# EAGLE design maze001 (EAGLE 5.04)
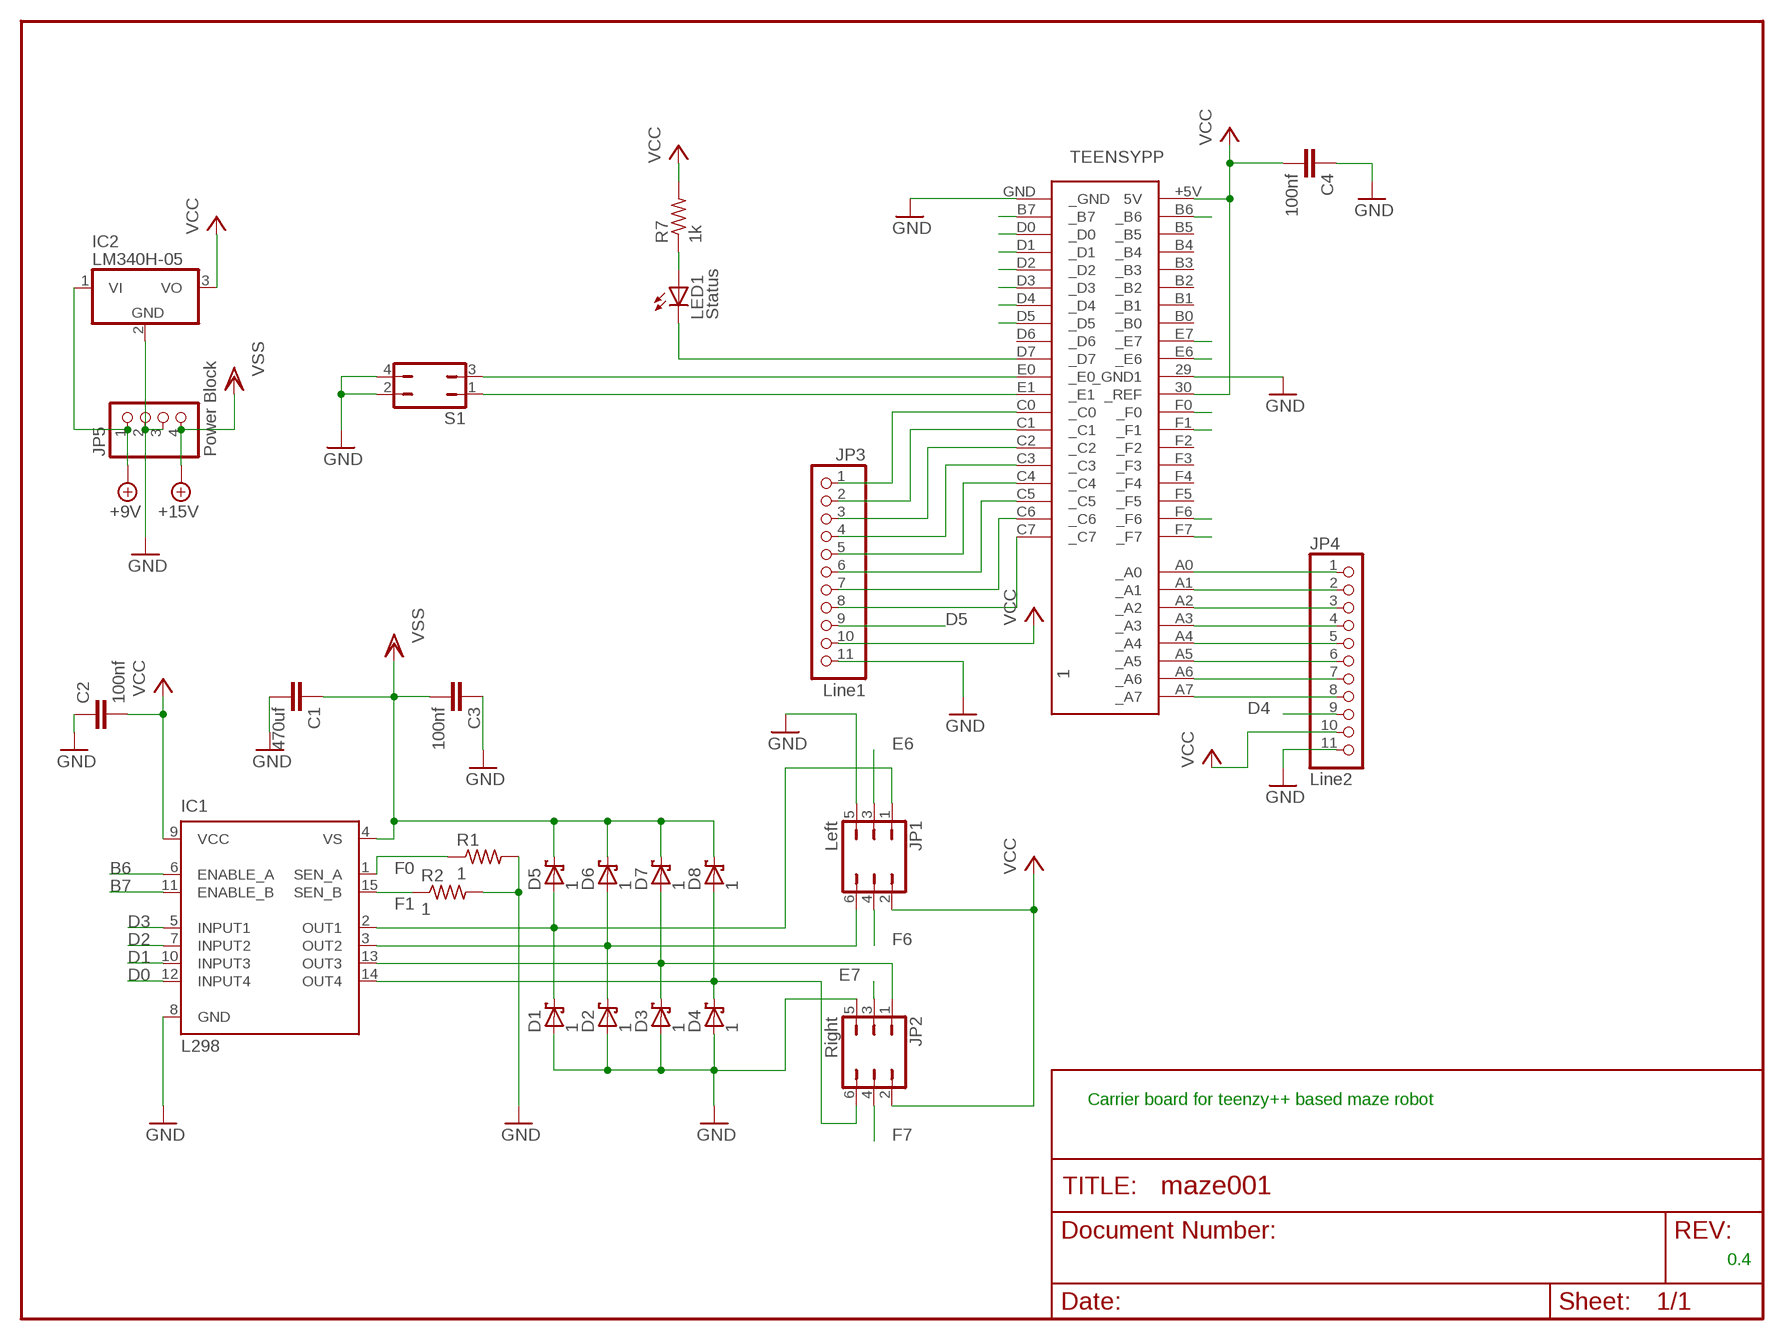
[diagram p0: schematic, sheet 1]

## Parts
C1  470uf  C2,5-3  [C2.5-3]
C2  100nf  C2,5-3  [C2.5-3]
C3  100nf  C2,5-3  [C2.5-3]
C4  100nf  C2,5-3  [C2.5-3]
D1  1  SCHOTTKY-DIODETO92H  [TO92H]
D2  1  SCHOTTKY-DIODETO92H  [TO92H]
D3  1  SCHOTTKY-DIODETO92H  [TO92H]
D4  1  SCHOTTKY-DIODETO92H  [TO92H]
D5  1  SCHOTTKY-DIODETO92H  [TO92H]
D6  1  SCHOTTKY-DIODETO92H  [TO92H]
D7  1  SCHOTTKY-DIODETO92H  [TO92H]
D8  1  SCHOTTKY-DIODETO92H  [TO92H]
IC1  L298  [MULTIWATT-15]
IC2  LM340H-05  [TO220H]
JP1  Left  JP3Q  [JP3Q]
JP2  Right  JP3Q  [JP3Q]
JP3  Line1  PINHD-1X11  [1X11]
JP4  Line2  PINHD-1X11  [1X11]
JP5  Power Block  PINHD-1X4  [1X04]
LED1  Status  LEDLD260  [LD260]
R1  1  R-US_0204/7  [0204/7]
R2  1  R-US_0204/7  [0204/7]
R7  1k  R-US_0204/7  [0204/7]
S1  JP2Q  [JP2Q]
TEENSYPP  1  TEENSYPP  [TEENSYPP]

## Nets
+9V: IC2.1(VI) JP5.1
B6: IC1.6(ENABLE_A) TEENSYPP.B6(_B6)
B7: IC1.11(ENABLE_B) TEENSYPP.B7(_B7)
D0: IC1.12(INPUT4) TEENSYPP.D0(_D0)
D1: IC1.10(INPUT3) TEENSYPP.D1(_D1)
D2: IC1.7(INPUT2) TEENSYPP.D2(_D2)
D3: IC1.5(INPUT1) TEENSYPP.D3(_D3)
D4: JP4.9 TEENSYPP.D4(_D4)
D5: JP3.9 TEENSYPP.D5(_D5)
E6: JP1.3 TEENSYPP.E6(_E6)
E7: JP2.3 TEENSYPP.E7(_E7)
F0: IC1.1(SEN_A) R1.1 TEENSYPP.F0(_F0)
F1: IC1.15(SEN_B) R2.1 TEENSYPP.F1(_F1)
F6: JP1.4 TEENSYPP.F6(_F6)
F7: JP2.4 TEENSYPP.F7(_F7)
GND: C1.2 C2.1 C3.1 C4.1 D1.1(A) D2.1(A) D3.1(A) D4.1(A) IC1.8(GND) IC2.2(GND) JP1.5 JP2.5 JP3.11 JP4.11 JP5.2 JP5.3 R1.2 R2.2 S1.2 S1.4 TEENSYPP.29(_GND1) TEENSYPP.GND(_GND)
N$1: LED1.K(C) TEENSYPP.D7(_D7)
N$2: S1.3 TEENSYPP.E0(_E0)
N$3: JP3.8 TEENSYPP.C7(_C7)
N$4: JP3.7 TEENSYPP.C6(_C6)
N$5: JP3.6 TEENSYPP.C5(_C5)
N$6: JP4.7 TEENSYPP.A6(_A6)
N$7: JP4.2 TEENSYPP.A1(_A1)
N$8: D3.2(C) D7.1(A) IC1.13(OUT3) JP2.1
N$9: LED1.A R7.1
N$10: D1.2(C) D5.1(A) IC1.2(OUT1) JP1.1
N$11: D2.2(C) D6.1(A) IC1.3(OUT2) JP1.6
N$12: JP3.2 TEENSYPP.C1(_C1)
N$13: D4.2(C) D8.1(A) IC1.14(OUT4) JP2.6
N$14: JP4.3 TEENSYPP.A2(_A2)
N$15: JP3.1 TEENSYPP.C0(_C0)
N$16: JP3.4 TEENSYPP.C3(_C3)
N$17: JP3.3 TEENSYPP.C2(_C2)
N$18: JP3.5 TEENSYPP.C4(_C4)
N$19: JP4.1 TEENSYPP.A0(_A0)
N$20: S1.1 TEENSYPP.E1(_E1)
N$24: JP4.4 TEENSYPP.A3(_A3)
N$25: JP4.5 TEENSYPP.A4(_A4)
N$26: JP4.6 TEENSYPP.A5(_A5)
N$28: JP4.8 TEENSYPP.A7(_A7)
VCC: C2.2 C4.2 IC1.9(VCC) IC2.3(VO) JP1.2 JP2.2 JP3.10 JP4.10 R7.2 TEENSYPP.30(_REF) TEENSYPP.+5V(5V)
VSS: C1.1 C3.2 D5.2(C) D6.2(C) D7.2(C) D8.2(C) IC1.4(VS) JP5.4 ; supply symbol labelled +15V
Unconnected: TEENSYPP.B0(_B0) TEENSYPP.B1(_B1) TEENSYPP.B2(_B2) TEENSYPP.B3(_B3) TEENSYPP.B4(_B4) TEENSYPP.B5(_B5) TEENSYPP.D6(_D6) TEENSYPP.F2(_F2) TEENSYPP.F3(_F3) TEENSYPP.F4(_F4) TEENSYPP.F5(_F5)

## Notes on the sheet
- Carrier board for teenzy++ based maze robot
- 0.4

## Library data of the parts
C1-C4 = capacitor-wima:C: CAPACITOR naming: grid - package width
D1-D8 = diode:SCHOTTKY-DIODE: Schottky Diode
IC1 = st-microelectronics:L298: DUAL FULL-BRIDGE DRIVER
IC2 = linear:LM340?-*: Positive VOLTAGE REGULATOR Source: http://cache.national.com/ds/LM/LM340.pdf
JP1 JP2 = jumper:JP3Q: JUMPER
JP3 JP4 = pinhead:PINHD-1X11: PIN HEADER
JP5 = pinhead:PINHD-1X4: PIN HEADER
LED1 = led:LED: LED OSRAM: - CHIPLED LG R971, LG N971, LY N971, LG Q971, LY Q971, LO R971, LY R971 LH N974, LH R974 LS Q976, LO Q976, LY Q976 LO Q996 - Hyper CHIPLED LW Q18S LB Q993, LB Q99A, LB R99A - SideLED LS A670, LO A670, LY A670, LG A670, LP A670 LB A673, LV A673, LT A673, LW A673 LH A674 LY A675 LS A676, LA A676, LO A676, LY A676, LW A676 LS A679, LY A679, LG A679 - Hyper Micro SIDELED® LS Y876, LA Y876, LO Y876, LY Y876 LT Y87S - SmartLED LW L88C, LW L88S LB L89C, LB L89S, LG L890 LS L89K, LO L89K, LY L89K LS L896, LA L896, LO L896, LY L896 - TOPLED LS T670, LO T670, LY T670, LG T670, LP T670 LSG T670, LSP T670, LSY T670, LOP T670, LYG T670 LG T671, LOG T671, LSG T671 LB T673, LV T673, LT T673, LW T673 LH T674 LS T676, LA T676, LO T676, LY T676, LB T676, LH T676, LSB T676, LW T676 LB T67C, LV T67C, LT T67C, LS T67K, LO T67K, LY T67K, LW E67C LS E67B, LA E67B, LO E67B, LY E67B, LB E67C, LV E67C, LT E67C LW T67C LS T679, LY T679, LG T679 LS T770, LO T770, LY T770, LG T770, LP T770 LB T773, LV T773, LT T773, LW T773 LH T774 LS E675, LA E675, LY E675, LS T675 LS T776, LA T776, LO T776, LY T776, LB T776 LHGB T686 LT T68C, LB T68C - Hyper Mini TOPLED® LB M676 - Mini TOPLED Santana® LG M470 LS M47K, LO M47K, LY M47K Source: http://www.osram.convergy.de LUXEON: - LUMILED® LXK2-PW12-R00, LXK2-PW12-S00, LXK2-PW14-U00, LXK2-PW14-V00 LXK2-PM12-R00, LXK2-PM12-S00, LXK2-PM14-U00 LXK2-PE12-Q00, LXK2-PE12-R00, LXK2-PE12-S00, LXK2-PE14-T00, LXK2-PE14-U00 LXK2-PB12-K00, LXK2-PB12-L00, LXK2-PB12-M00, LXK2-PB14-N00, LXK2-PB14-P00, LXK2-PB14-Q00 LXK2-PR12-L00, LXK2-PR12-M00, LXK2-PR14-Q00, LXK2-PR14-R00 LXK2-PD12-Q00, LXK2-PD12-R00, LXK2-PD12-S00 LXK2-PH12-R00, LXK2-PH12-S00 LXK2-PL12-P00, LXK2-PL12-Q00, LXK2-PL12-R00 Source: www.luxeon.com KINGBRIGHT: KA-3528ASYC Source: www.kingbright.com
R1 R2 R7 = resistor:R-US_: RESISTOR, American symbol
S1 = jumper:JP2Q: JUMPER
TEENSYPP = teensypp:TEENSYPP: teensyPP

## Board
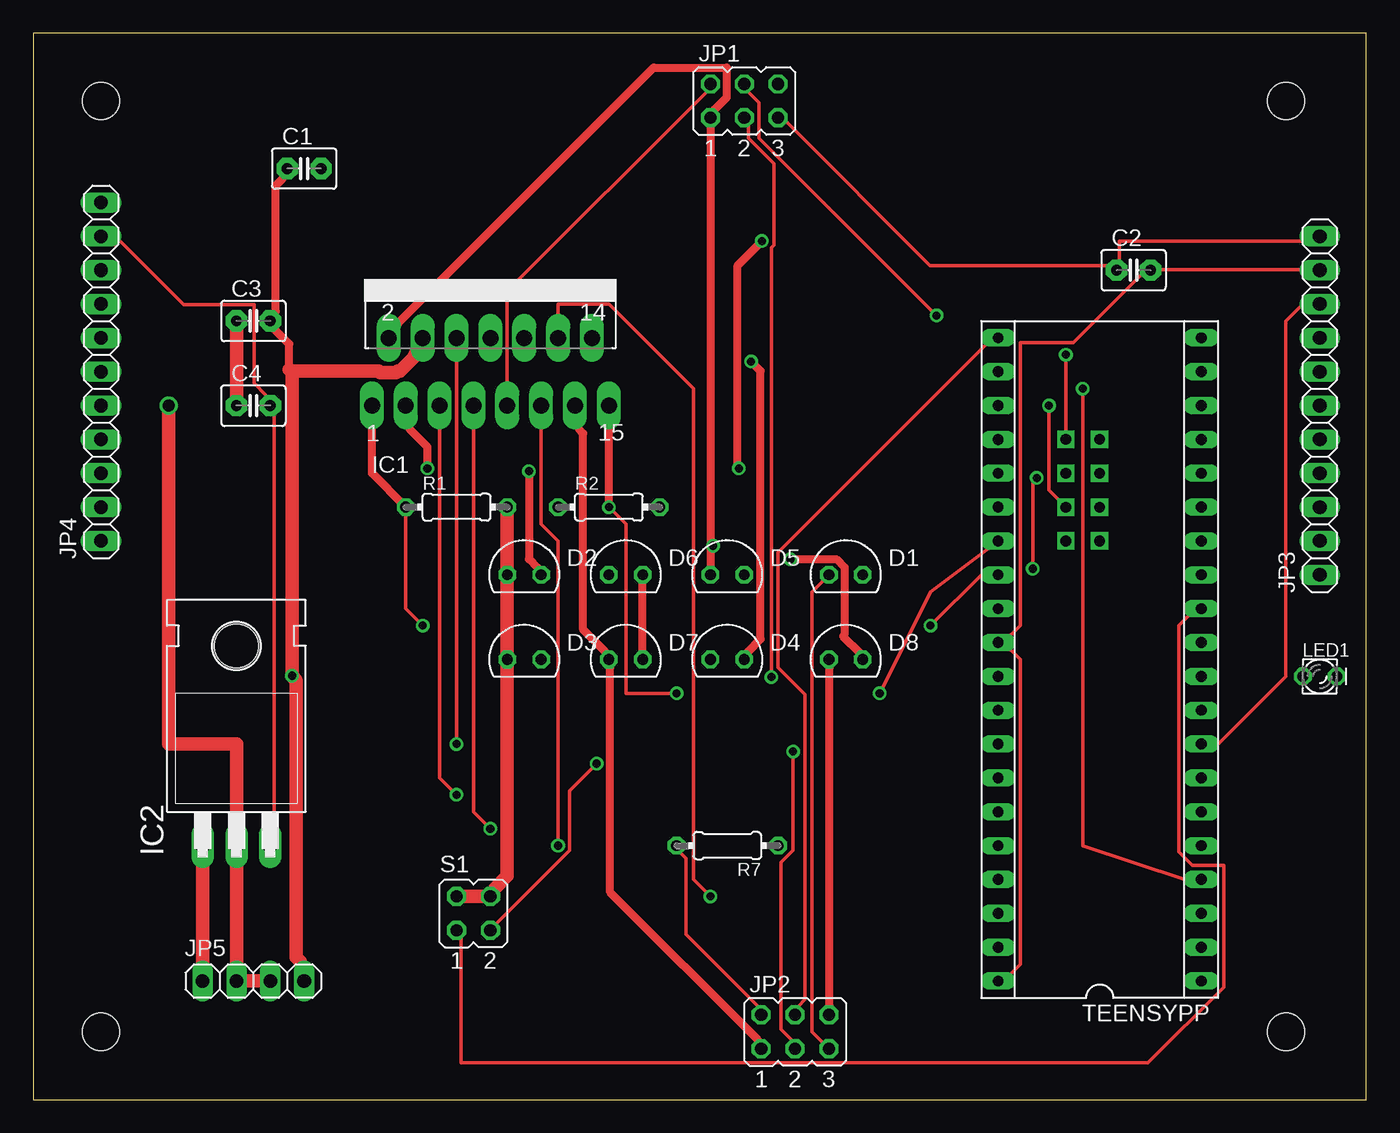
[diagram p1: board, top side]
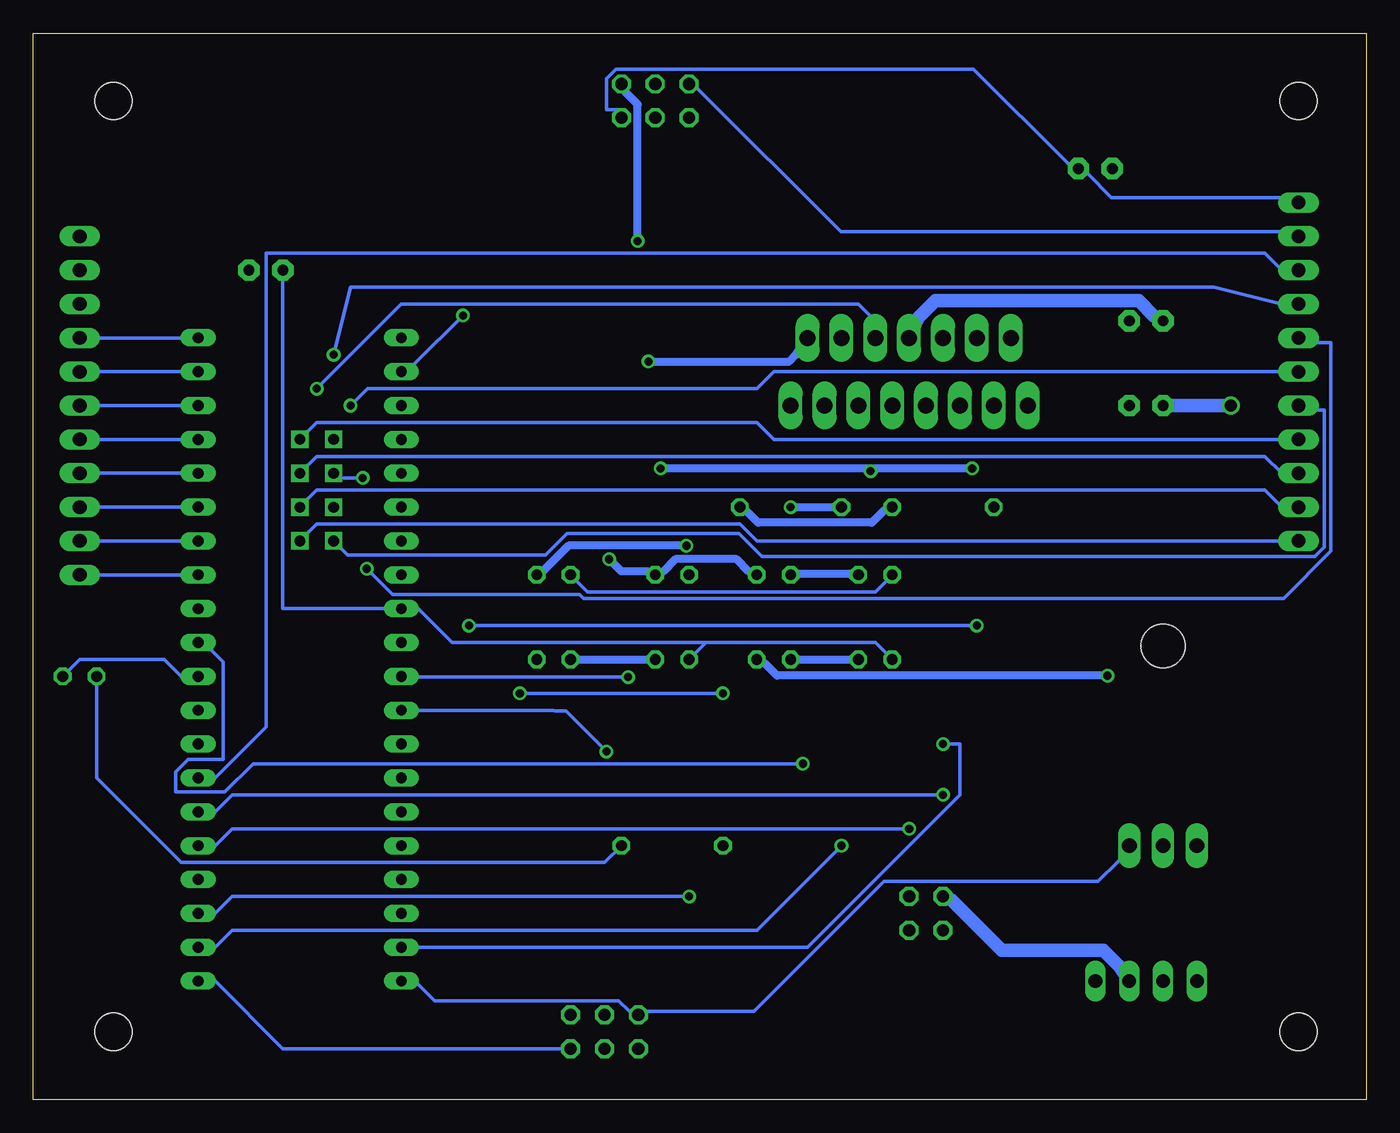
[diagram p2: board, bottom side, seen from below]

Size 100 x 80 mm. Coordinates in mm from the lower left corner, seen from the top.
Outline: 0,0 100,0 100,80 0,80 0,0
Copper layers (1*16): Top 0.035mm / dielectric 1.5mm / Bottom 0.035mm
Design rules "default *": minimum track width 10mil, minimum drill 24mil, track to track 10mil, track to pad 8mil, pad to pad 8mil, via to via 8mil, smd to smd 8mil, copper to edge 40mil, drill to drill 8mil, minimum pad ring 10mil, minimum via ring 8mil, stop-mask expansion 4mil, vias tented up to drill 0mil, thermal gap 10mil
Holes 2.8 mm at 5.08,5.08 93.98,5.08 93.98,74.93 5.08,74.93

### Footprints (pad centres in the part's own frame; a part is rotated, then mirrored left to right if it is on the bottom)
C2.5-3 = drill 0.813 pad 1.6 octagon: 1 -1.27,0; 2 1.27,0
TO92H = drill 0.813 octagon: 1 -1.27,0; 2 1.27,0
MULTIWATT-15 = drill 1.2 long: 1 -8.89,-7.62; 2 -7.62,-2.54; 3 -6.35,-7.62; 4 -5.08,-2.54; 5 -3.81,-7.62; 6 -2.54,-2.54; 7 -1.27,-7.62; 8 0,-2.54; 9 1.27,-7.62; 10 2.54,-2.54; 11 3.81,-7.62; 12 5.08,-2.54; 13 6.35,-7.62; 14 7.62,-2.54; 15 8.89,-7.62
TO220H = drill 1.118 long: 1 -2.54,-10.16; 2 0,-10.16; 3 2.54,-10.16 | hole 3.302: 0,4.826
JP3Q = drill 0.914 octagon: 1 -2.54,-1.27; 2 -2.54,1.27; 3 0,-1.27; 4 0,1.27; 5 2.54,-1.27; 6 2.54,1.27
1X11 = drill 1.016 long: 1 -12.7,0; 2 -10.16,0; 3 -7.62,0; 4 -5.08,0; 5 -2.54,0; 6 0,0; 7 2.54,0; 8 5.08,0; 9 7.62,0; 10 10.16,0; 11 12.7,0
1X04 = drill 1.016 long: 1 -3.81,0; 2 -1.27,0; 3 1.27,0; 4 3.81,0
LD260 = drill 0.813 octagon: A -1.27,0; K 1.27,0
0204/7 = drill 0.813 octagon: 1 -3.81,0; 2 3.81,0
JP2Q = drill 0.914 octagon: 1 -1.27,-1.27; 2 -1.27,1.27; 3 1.27,-1.27; 4 1.27,1.27
TEENSYPP = drill 0.813 long: 29 3.81,7.62; 30 1.27,7.62; +5V -24.13,7.62; B0 -6.35,7.62; B1 -8.89,7.62; B2 -11.43,7.62; B3 -13.97,7.62; B4 -16.51,7.62; B5 -19.05,7.62; B6 -21.59,7.62; B7 -21.59,-7.62; C0 6.35,-7.62; C1 8.89,-7.62; C2 11.43,-7.62; C3 13.97,-7.62; C4 16.51,-7.62; C5 19.05,-7.62; C6 21.59,-7.62; C7 24.13,-7.62; D0 -19.05,-7.62; D1 -16.51,-7.62; D2 -13.97,-7.62; D3 -11.43,-7.62; D4 -8.89,-7.62; D5 -6.35,-7.62; D6 -3.81,-7.62; D7 -1.27,-7.62; E0 1.27,-7.62; E1 3.81,-7.62; E6 -1.27,7.62; E7 -3.81,7.62; F0 6.35,7.62; F1 8.89,7.62; F2 11.43,7.62; F3 13.97,7.62; F4 16.51,7.62; F5 19.05,7.62; F6 21.59,7.62; F7 24.13,7.62; GND -24.13,-7.62 | drill 0.8 square: A0 8.89,0; A1 11.43,0; A2 13.97,0; A3 16.51,0; A4 8.89,2.54; A5 11.43,2.54; A6 13.97,2.54; A7 16.51,2.54

### Placement (x,y rotation side)
C1  20.32,69.85 0 top
C2  82.55,62.23 0 top
C3  16.51,58.42 0 top
C4  16.51,52.07 0 top
D1  60.96,39.37 0 top
D2  36.83,39.37 0 top
D3  36.83,33.02 0 top
D4  52.07,33.02 0 top
D5  52.07,39.37 0 top
D6  44.45,39.37 0 top
D7  44.45,33.02 0 top
D8  60.96,33.02 0 top
IC1  34.29,59.69 0 top
IC2  15.24,29.21 0 top
JP1  53.34,74.93 0 top
JP2  57.15,5.08 0 top
JP3  96.52,52.07 90 top
JP4  5.08,54.61 90 top
JP5  16.51,8.89 0 top
LED1  96.52,31.75 0 top
R1  31.75,44.45 0 top
R2  43.18,44.45 0 top
R7  52.07,19.05 180 top
S1  33.02,13.97 0 top
TEENSYPP  80.01,33.02 90 top

### Tracks (layer width: path | path; a pad name or v marks a point on that pad's centre or on a via)
+9V
  Top 1.016: JP5.1 IC2.1
B6  (via drill 0.61)
  Top 0.254: v31.75,26.67 IC1.6
  Bottom 0.254: v31.75,26.67 30.48,26.67 30.48,22.86 41.91,11.43 TEENSYPP.B6
B7  (via drill 0.61)
  Top 0.254: v39.37,19.05 39.37,41.91 38.1,43.18 IC1.11
  Bottom 0.254: v39.37,19.05 45.72,12.7 85.09,12.7 86.36,11.43 TEENSYPP.B7
D0  (via drill 0.61)
  Top 0.254: v50.8,15.24 49.53,16.51 49.53,53.34 43.18,59.69 39.37,59.69 IC1.12
  Bottom 0.254: v50.8,15.24 85.09,15.24 86.36,13.97 TEENSYPP.D0
D1  (via drill 0.61)
  Top 0.254: v78.74,53.34 78.74,19.05 86.36,16.51 TEENSYPP.D1
  Bottom 0.254: v78.74,53.34 72.39,59.69 38.1,59.69 36.83,58.42 IC1.10
D2  (via drill 0.61)
  Top 0.254: v34.29,20.32 33.02,21.59 IC1.7
  Bottom 0.254: v34.29,20.32 85.09,20.32 86.36,19.05 TEENSYPP.D2
D3  (via drill 0.61)
  Top 0.254: v31.75,22.86 30.48,24.13 IC1.5
  Bottom 0.254: v31.75,22.86 85.09,22.86 86.36,21.59 TEENSYPP.D3
D4
  Bottom 0.254: TEENSYPP.D4 86.36,24.13 82.55,27.94 82.55,63.5 7.62,63.5 6.35,62.23 JP4.9
D5
  Top 0.254: TEENSYPP.D5 88.9,26.67 93.98,31.75 93.98,58.42 95.25,59.69 JP3.9
E6  (via drill 0.61)
  Top 0.254: v55.37,31.7 55.37,63.91 55.58,64.11 55.58,70.21 53.65,72.14 53.65,73.05 JP1.3
  Bottom 0.254: v55.37,31.7 71.12,31.7 TEENSYPP.E6
E7  (via drill 0.61)
  Top 0.254: v57,26.11 57,18.69 56.08,17.78 56.08,5.28 56.9,4.47 JP2.3
  Bottom 0.254: TEENSYPP.E7 60.96,29.21 60.86,29.16 60.05,29.16 v57,26.11
F0  (via drill 0.61)
  Top 0.254: v67.31,35.56 71.12,39.37 TEENSYPP.F0 | v29.21,35.56 27.94,36.83 R1.1
  Top 0.61: R1.1 25.4,46.99 IC1.1
  Bottom 0.254: v29.21,35.56 v67.31,35.56
F1  (via drill 0.61)
  Top 0.254: v63.5,30.48 67.31,38.1 TEENSYPP.F1 | v48.26,30.48 44.45,30.48 44.45,43.18 v43.18,44.45
  Top 0.61: v43.18,44.45 IC1.15
  Bottom 0.254: v48.26,30.48 v63.5,30.48
  Bottom 0.61: v43.18,44.45 R2.1
F6  (via drill 0.61)
  Top 0.254: v67.77,58.83 54.46,72.14 54.46,74.78 53.65,75.59 JP1.4
  Bottom 0.254: v67.77,58.83 71.42,55.17 TEENSYPP.F6
F7
  Top 0.254: TEENSYPP.F7 71.42,56.59 55.88,41.05 55.88,32.41 57.91,30.38 57.91,7.52 57.4,7.01 JP2.4
GND  (via drill 0.9)
  Top 0.254: JP2.5 58.42,5.08 58.42,38.1 D1.1 | JP1.5 56.49,73.36 67.26,62.59 80.67,62.59 C2.1 81.48,62.99 81.48,64.41 95.1,64.41 JP3.11
  Top 0.61: S1.4 34.65,15.85
  Top 1.016: JP5.3 JP5.2 15.24,17.78 | 15.24,17.78 IC2.2 | v10.16,52.07 10.16,26.67 15.24,26.67 15.24,17.78 | C4.1 C3.1 | R1.2 D2.1 D3.1 35.56,16.76 34.65,15.85 | S1.2 S1.4
  Bottom 0.254: JP2.5 81.28,3.81 86.36,8.89 TEENSYPP.GND | 49.53,34.29 D4.1 | 49.53,34.29 36.83,34.29 D3.1 | D1.1 58.42,38.1 36.83,38.1 D2.1 | 49.53,34.29 68.58,34.29 71.12,36.83 TEENSYPP.29 81.28,36.83 C2.1 | JP4.11 6.5,67.67 19.1,67.67 20.93,69.49 C1.2 22.35,70.21 29.46,77.32 56.29,77.32 57,76.61 57,74.27 56.19,74.27 JP1.5
  Bottom 0.61: R2.2 46.43,44.09 45.62,43.28 37.08,43.28 36.17,44.2 R1.2
  Bottom 1.016: IC1.8 33.63,58.62 32.31,59.94 17.07,59.94 15.95,58.83 C3.1 | v10.16,52.07 C4.1 | S1.2 31.09,14.94 27.33,11.18 19.71,11.18 18.49,9.96 JP5.3
N$1
  Bottom 0.254: LED1.K 96.52,33.02 90.17,33.02 88.9,31.75 TEENSYPP.D7
N$2  (via drill 0.61)
  Top 0.254: v42.27,25.2 40.23,23.16 40.23,18.69 34.75,13.21 S1.3
  Bottom 0.254: v42.27,25.2 83.52,25.2 85.65,23.06 89.31,23.06 89.31,24.59 88.39,25.5 85.75,25.5 85.75,32.82 86.67,33.73 TEENSYPP.E0
N$3
  Bottom 0.254: TEENSYPP.C7 JP3.8
N$4
  Bottom 0.254: TEENSYPP.C6 JP3.7
N$5
  Bottom 0.254: TEENSYPP.C5 JP3.6
N$6  (via drill 0.61)
  Top 0.254: v75.29,46.63 74.98,46.33 v74.98,39.83
  Bottom 0.254: v75.29,46.63 76.91,46.63 TEENSYPP.A6 | v74.98,39.83 73.05,37.9 59.03,37.9 58.73,37.59 6.2,37.59 2.64,41.15 2.64,56.79 3.66,56.79 JP4.7
N$7
  Bottom 0.254: TEENSYPP.A1 78.74,45.72 7.62,45.72 6.35,44.45 JP4.2
N$8
  Top 0.61: JP2.1 54.36,4.47 43.28,15.54 43.28,32.41 D7.1 42.88,33.63 41.25,35.26 41.25,49.99 40.95,50.29 IC1.13
  Bottom 0.61: D7.1 D3.2
N$9
  Bottom 0.254: R7.1 57.15,17.78 88.9,17.78 95.25,24.13 LED1.A
N$10  (via drill 0.61)
  Top 0.61: 50.8,41.55 D5.1 | 50.8,41.55 JP1.1 51.1,74.27 52.02,75.18 52.02,77.42 46.53,77.42 27.53,58.42 IC1.2 | 50.8,41.55 v51,41.55
  Bottom 0.61: v51,41.55 59.84,41.55 61.67,39.73 D1.2
N$11  (via drill 0.61)
  Top 0.61: v54.66,64.41 52.83,62.59 52.83,47.45 v52.93,47.35 | v29.57,47.35 29.57,48.97 28.25,50.29 IC1.3 | v37.19,47.14 37.19,40.54 37.8,39.93 D2.2
  Bottom 0.61: D2.2 38.71,39.42 42.57,39.42 D6.1 | v54.66,64.41 54.66,74.68 55.58,75.59 JP1.6 | v29.57,47.35 37.19,47.35 | 37.19,47.35 v52.93,47.35 | 37.19,47.35 v37.19,47.14
N$12
  Bottom 0.254: TEENSYPP.C1 JP3.2
N$13  (via drill 0.61)
  Top 0.61: JP2.6 59.74,7.01 59.74,32.41 D8.1 | v53.85,55.37 54.56,54.66 54.56,34.54 53.65,33.63 D4.2
  Bottom 0.61: D8.1 D4.2 | v53.85,55.37 43.28,55.37 42.77,55.88 IC1.14
N$14
  Bottom 0.254: TEENSYPP.A2 78.74,48.26 7.62,48.26 6.35,46.99 JP4.3
N$15
  Bottom 0.254: TEENSYPP.C0 JP3.1
N$16
  Bottom 0.254: TEENSYPP.C3 JP3.4
N$17
  Bottom 0.254: TEENSYPP.C2 JP3.3
N$18
  Bottom 0.254: TEENSYPP.C4 JP3.5
N$19
  Bottom 0.254: TEENSYPP.A0 78.74,43.18 46.99,43.18 45.72,41.91 JP4.1
N$20
  Top 0.254: TEENSYPP.E1 86.67,36.27 85.95,35.56 85.95,18.59 86.97,17.58 89.31,17.58 89.31,8.43 83.62,2.74 32.11,2.74 32.11,12.09 S1.1
N$24
  Bottom 0.254: TEENSYPP.A3 78.74,50.8 45.72,50.8 44.45,49.53 JP4.4
N$25
  Bottom 0.254: TEENSYPP.A4 76.4,40.84 61.57,40.84 59.94,42.47 47.04,42.47 45.31,40.74 3.86,40.74 3.15,41.45 3.15,51.71 3.66,51.71 JP4.5
N$26  (via drill 0.61)
  Top 0.254: TEENSYPP.A5 76.2,45.72 v76.2,52.07
  Bottom 0.254: v76.2,52.07 74.93,53.34 45.72,53.34 44.45,54.61 JP4.6
N$28  (via drill 0.61)
  Top 0.254: v77.47,55.88 TEENSYPP.A7
  Bottom 0.254: v77.47,55.88 76.2,60.96 11.43,60.96 6.35,59.69 JP4.8
VCC
  Top 0.254: 17.78,20.32 IC2.3 18.09,20.52 18.09,51.51 C4.2 17.48,52.83 16.56,53.75 16.56,59.64 11.28,59.64 6.5,64.41 JP4.10 6.2,64.11 | R7.2 48.56,18.49 48.97,18.09 48.97,12.39 54.36,7.01 JP2.2 | JP1.2 50.49,75.59 35.56,60.66 IC1.9 | JP3.10 95.1,62.28 84.53,62.28 C2.2 83.11,61.87 78.03,56.79 74.07,56.79 74.07,35.56 73.36,34.85 TEENSYPP.30 73.36,33.73 74.07,33.02 74.07,10.16 73.36,9.45 TEENSYPP.+5V
  Bottom 0.254: JP1.2 50.19,75.89 39.42,65.13 6.5,65.13 JP4.10 | TEENSYPP.+5V 71.12,8.64 69.9,7.42 56.08,7.42 55.27,6.6 JP2.2 53.95,6.6 45.92,6.6 36.17,16.36 20.12,16.36 18.59,17.88 IC2.3
VSS  (via drill 0.61)
  Top 0.61: D7.2 D6.2 | D8.2 61.98,33.53 60.76,34.75 60.86,34.95 60.86,39.93 60.25,40.54 v56.79,40.54 | 19.2,54.76 19.2,56.69 18.19,57.71 C3.2 18.19,59.13 18.19,68.58 18.69,69.09 C1.1 | v19.41,31.8 19.2,31.8
  Top 1.016: 19.41,54.66 25.91,54.66 26.01,54.56 27.23,54.56 27.33,54.66 27.53,54.66 28.55,55.68 IC1.4 | 19.41,54.66 19.2,54.76 | JP5.4 20.02,10.36 19.71,10.67 19.71,31.39 v19.41,31.8 19.41,54.66
  Bottom 0.61: v19.41,31.8 44.2,31.8 45.11,32.72 D7.2 | D6.2 46.33,39.62 47.24,40.54 51.82,40.54 52.73,39.62 D5.2 53.95,39.62 55.88,39.62 v56.79,40.54